# Altium schematic sheet SampleCompact.SchDoc
size A4; SheetNumber: 2; SheetTotal: 5
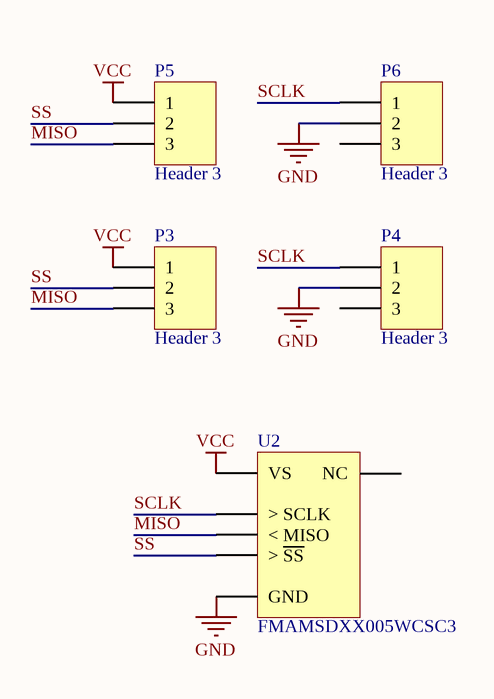
[diagram p0: SampleCompact.SchDoc]

## Parts
P3  Header 3  [HDR1X3]
P4  Header 3  [HDR1X3]
P5  Header 3  [HDR1X3]
P6  Header 3  [HDR1X3]
U2  FMAMSDXX005WCSC3  [FMA_MICROFORCE_6]

## Nets
GND: P4.2 P6.2 U2.3(GND)
VCC: P3.1 P5.1 U2.1(VS)
MISO: P3.3 P5.3 U2.5(<_MISO)
SCLK: P4.1 P6.1 U2.4(>_SCLK)
SS: P3.2 P5.2 U2.2(>_~{SS})

Not connected (* = marked no-connect by the designer): P4 3; P6 3; U2 6(NC)

## Library data of the parts
P3-P6 = Header 3: Header, 3-Pin; LatestRevisionDate: 17-Jul-2002; LatestRevisionNote: Re-released for DXP Platform.; Publisher: Altium Limited
U2 = FMAMSDXX005WCSC3: Force Range: 5N / Output: SPI / FMA Series Force Sensor, compensated/amplified, mechanically / coupled, sphere contact element, sensor short and open / diagnostics, 5 N force range, compression force type, SPI digital / output, 20% to 80% transfer function, 3.3 V ±10% supply voltage